# Altium schematic sheet digit.SchDoc
size A4
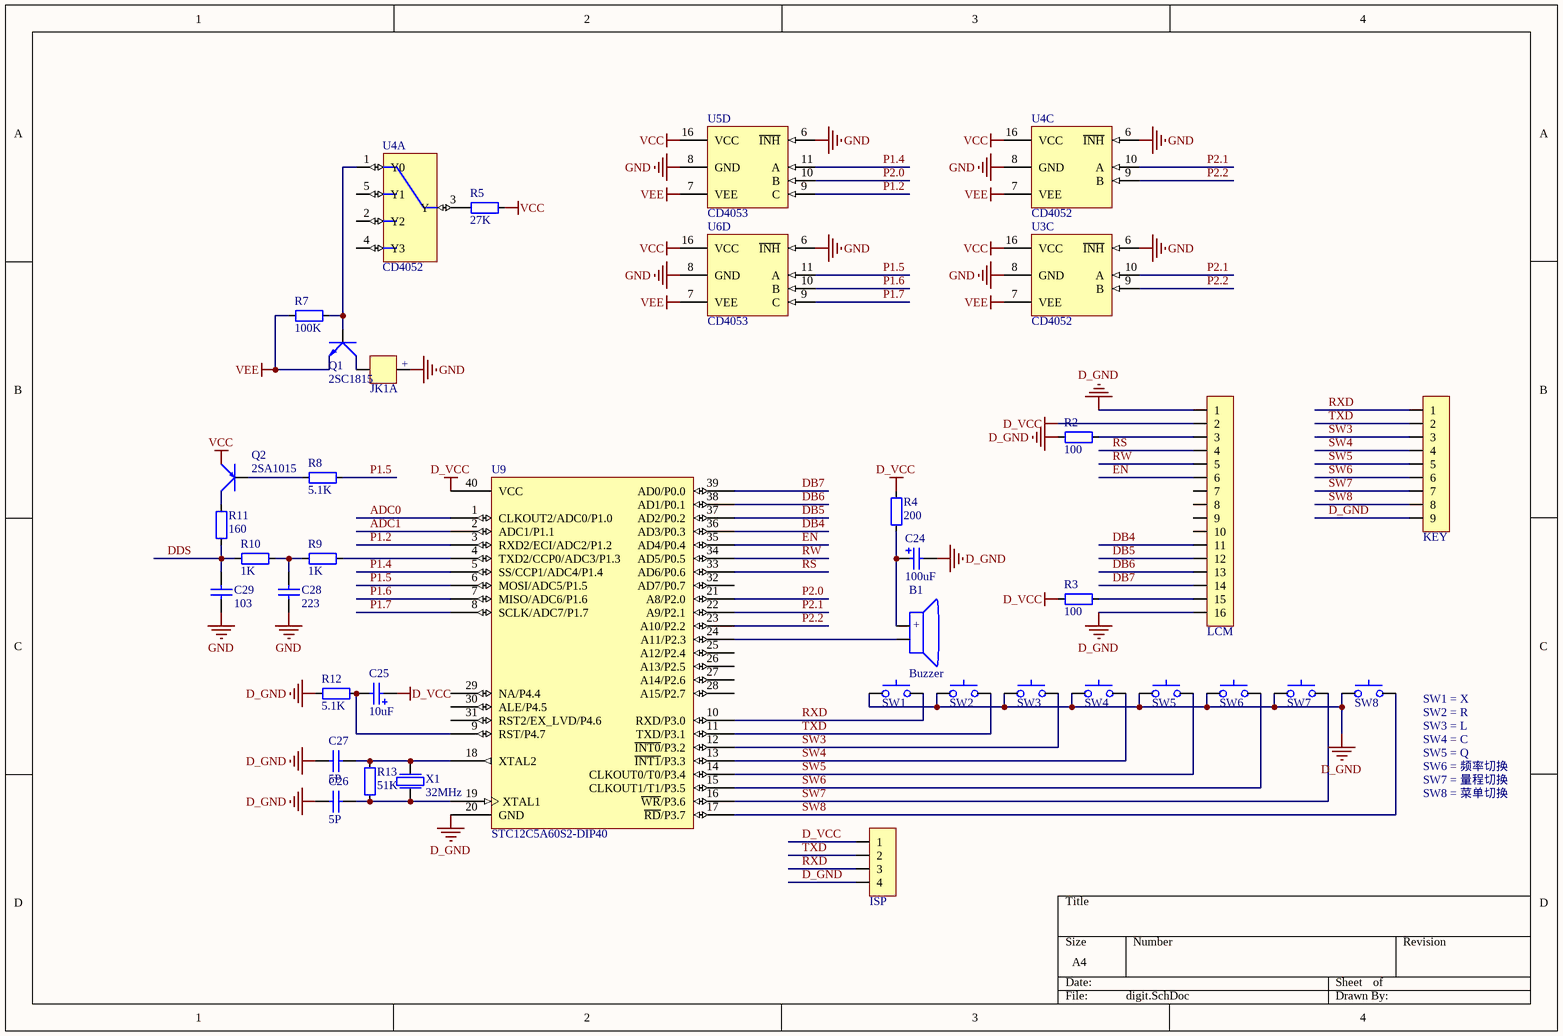
[diagram p0: digit.SchDoc]

## Parts
B1  Buzzer  [Buzzer_1]
C24  value 100uF  [CR3]  (hidden comment: CAP POL)
C25  value 10uF  [CR2]  (hidden comment: CAP POL)
C26  value 5P  [C0805]  (hidden comment: CAP_SMD)
C27  value 5P  [C0805]  (hidden comment: CAP_SMD)
C28  value 223  [CL0704]  (hidden comment: CAP)
C29  value 103  [CL0704]  (hidden comment: CAP)
ISP  Socket P4  [SPH254-4]  (value not drawn)
JK1  JK-2  [JK-G6S2]  (value not drawn)  (part A of 3)
KEY  Socket P9  [XH254-9]  (value not drawn)
LCM  Socket P16  [XH254-16]  (value not drawn)
Q1  2SC1815  [TO-92]
Q2  2SA1015  [TO-92]
R2  value 100  [R0603]  (hidden comment: RES_SMD)
R3  value 100  [R0603]  (hidden comment: RES_SMD)
R4  value 200  [R0805]  (hidden comment: RES_SMD)
R5  value 27K  [R0805]  (hidden comment: RES_SMD)
R7  value 100K  [R0805]  (hidden comment: RES_SMD)
R8  value 5.1K  [R0805]  (hidden comment: RES_SMD)
R9  value 1K  [AXIAL-0.3]  (hidden comment: RES)
R10  value 1K  [AXIAL-0.3]  (hidden comment: RES)
R11  value 160  [AXIAL-0.3]  (hidden comment: RES)
R12  value 5.1K  [R0805]  (hidden comment: RES_SMD)
R13  value 51K  [R0805]  (hidden comment: RES_SMD)
SW1  SW  [SW0606]  (value not drawn)
SW2  SW  [SW0606]  (value not drawn)
SW3  SW  [SW0606]  (value not drawn)
SW4  SW  [SW0606]  (value not drawn)
SW5  SW  [SW0606]  (value not drawn)
SW6  SW  [SW0606]  (value not drawn)
SW7  SW  [SW0606]  (value not drawn)
SW8  SW  [SW0606]  (value not drawn)
U3  CD4052  [DIP16]  (part C of 3)
U4  CD4052  [DIP16]  (parts A,C of 3)
U5  CD4053  [DIP16]  (part D of 4)
U6  CD4053  [SOP16]  (part D of 4)
U9  STC12C5A60S2-DIP40  [DIP40]
X1  value 32MHz  [XTAL-HC49US]  (hidden comment: XTAL)

## Nets
D_GND: C24.2 C26.1 C27.1 ISP.4 KEY.9 LCM.1 LCM.16 R2.2 R12.1 SW1.1 SW2.1 SW3.1 SW4.1 SW5.1 SW6.1 SW7.1 SW8.1 U9.20(GND)
D_VCC: C25.1 ISP.1 LCM.2 R3.2 R4.2 U9.40(VCC)
GND: C28.1 C29.1 JK1.1 U3.6(~{INH}) U3.8(GND) U4.6(~{INH}) U4.8(GND) U5.6(~{INH}) U5.8(GND) U6.6(~{INH}) U6.8(GND)
VCC: Q2.3 R5.2 U3.16(VCC) U4.16(VCC) U5.16(VCC) U6.16(VCC)
VEE: Q1.3 R7.1 U3.7(VEE) U4.7(VEE) U5.7(VEE) U6.7(VEE)
ADC0: U9.1(CLKOUT2/ADC0/P1.0)
ADC1: U9.2(ADC1/P1.1)
DB4: LCM.11 U9.36(AD3/P0.3)
DB5: LCM.12 U9.37(AD2/P0.2)
DB6: LCM.13 U9.38(AD1/P0.1)
DB7: LCM.14 U9.39(AD0/P0.0)
DDS: C29.2 R10.1 R11.1
EN: LCM.6 U9.35(AD4/P0.4)
P1.2: U5.9(C) U9.3(RXD2/ECI/ADC2/P1.2)
P1.4: U5.11(A) U9.5(SS/CCP1/ADC4/P1.4)
P1.5: R8.2 U6.11(A) U9.6(MOSI/ADC5/P1.5)
P1.6: U6.10(B) U9.7(MISO/ADC6/P1.6)
P1.7: U6.9(C) U9.8(SCLK/ADC7/P1.7)
P2.0: U5.10(B) U9.21(A8/P2.0)
P2.1: U3.10(A) U4.10(A) U9.22(A9/P2.1)
P2.2: U3.9(B) U4.9(B) U9.23(A10/P2.2)
RS: LCM.4 U9.33(AD6/P0.6)
RW: LCM.5 U9.34(AD5/P0.5)
RXD: ISP.3 KEY.1 SW1.2 U9.10(RXD/P3.0)
SW3: KEY.3 SW3.2 U9.12(~{INT0}/P3.2)
SW4: KEY.4 SW4.2 U9.13(~{INT1}/P3.3)
SW5: KEY.5 SW5.2 U9.14(CLKOUT0/T0/P3.4)
SW6: KEY.6 SW6.2 U9.15(CLKOUT1/T1/P3.5)
SW7: KEY.7 SW7.2 U9.16(~{WR}/P3.6)
SW8: KEY.8 SW8.2 U9.17(~{RD}/P3.7)
TXD: ISP.2 KEY.2 SW2.2 U9.11(TXD/P3.1)
NetB1_1: B1.1 C24.1 R4.1
NetB1_2: B1.2 U9.24(A11/P2.3)
NetC25_2: C25.2 R12.2 U9.9(RST/P4.7)
NetC26_2: C26.2 R13.1 U9.19(XTAL1) X1.1
NetC27_2: C27.2 R13.2 U9.18(XTAL2) X1.3
NetC28_2: C28.2 R9.1 R10.2
NetJK1_8: JK1.8 Q1.2
NetLCM_3: LCM.3 R2.1
NetLCM_15: LCM.15 R3.1
NetQ1_1: Q1.1 R7.2 U4.1(Y0)
NetQ2_1: Q2.1 R8.1
NetQ2_2: Q2.2 R11.2
NetR5_1: R5.1 U4.3(Y)
NetR9_2: R9.2 U9.4(TXD2/CCP0/ADC3/P1.3)

Not connected (* = marked no-connect by the designer): LCM 7 8 9 10; U4 2(Y2) 4(Y3) 5(Y1); U9 25(A12/P2.4) 26(A13/P2.5) 27(A14/P2.6) 28(A15/P2.7) 29(NA/P4.4) 30(ALE/P4.5) 31(RST2/EX_LVD/P4.6) 32(AD7/P0.7)

## Notes on the sheet
- (near SW8) SW1 = X
- (near SW8) SW2 = R
- (near SW8) SW3 = L
- SW4 = C
- SW5 = Q
- SW6 = 频率切换
- SW7 = 量程切换
- SW8 = 菜单切换
- (in symbol Buzzer) +
- (in symbol JK-2, part A) +

## Library data of the parts
B1 = Buzzer: 蜂鸣器
C24 C25 = CAP POL: 插脚有极电容
C26 C27 = CAP_SMD: 贴片无极电容
C28 C29 = CAP: 插脚无极电容
JK1 = JK-2: 小型双刀双掷继电器
Q1 = 2SC1815: 低压小功率NPN管(0,15A/50V/0.4W)
Q2 = 2SA1015: 低压小功率PNP管(0.15A/50V/0.4W)
R2-R5 R7 R8 R12 R13 = RES_SMD: 贴片电阻
R9-R11 = RES: 插脚电阻
SW1-SW8 = SW: 小型按键开关
X1 = XTAL: 无源晶振